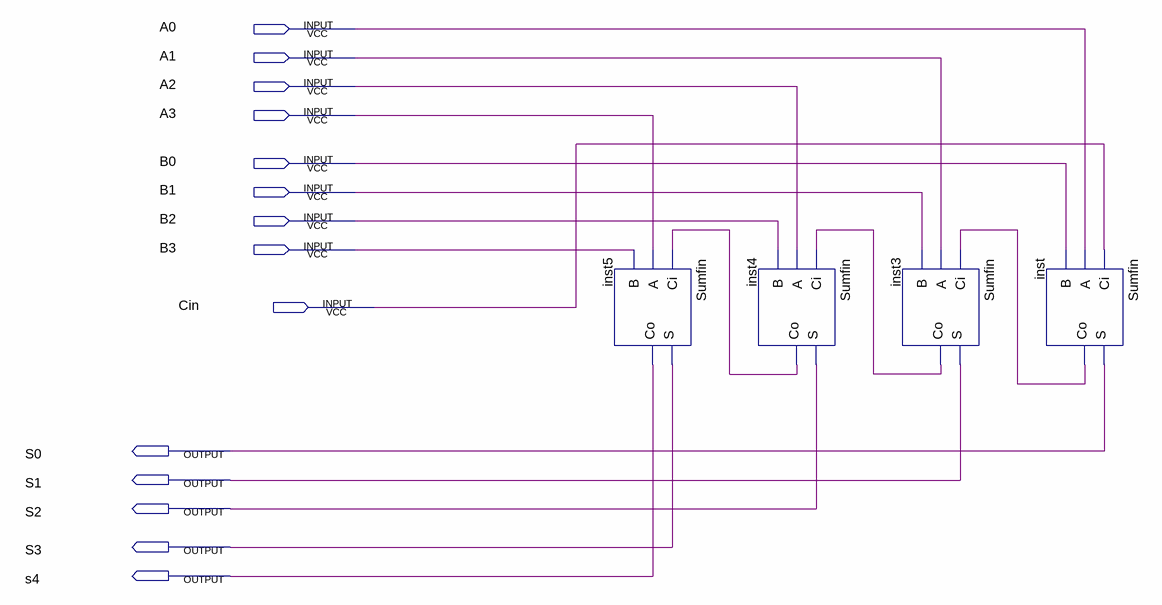
[diagram p0: schematic sheet]
// Quartus schematic Sumfin4bitsV2.bdf as structural Verilog: 4 symbols, 14 pins
module Sumfin4bitsV2 (
  input  A0,
  input  A1,
  input  A2,
  input  A3,
  input  B0,
  input  B1,
  input  B2,
  input  B3,
  input  Cin,
  output S0,
  output S1,
  output S2,
  output S3,
  output s4
);

  wire inst3_co, inst4_co, inst_co;

  Sumfin inst5 (.A(inst4_co), .B(A3), .Ci(B3), .S(S3), .Co(s4));
  Sumfin inst4 (.A(inst3_co), .B(A2), .Ci(B2), .S(S2), .Co(inst4_co));
  Sumfin inst3 (.A(inst_co), .B(A1), .Ci(B1), .S(S1), .Co(inst3_co));
  Sumfin inst (.A(Cin), .B(A0), .Ci(B0), .S(S0), .Co(inst_co));
endmodule
